# EAGLE board Robotics_Cape (EAGLE 7.7.0)
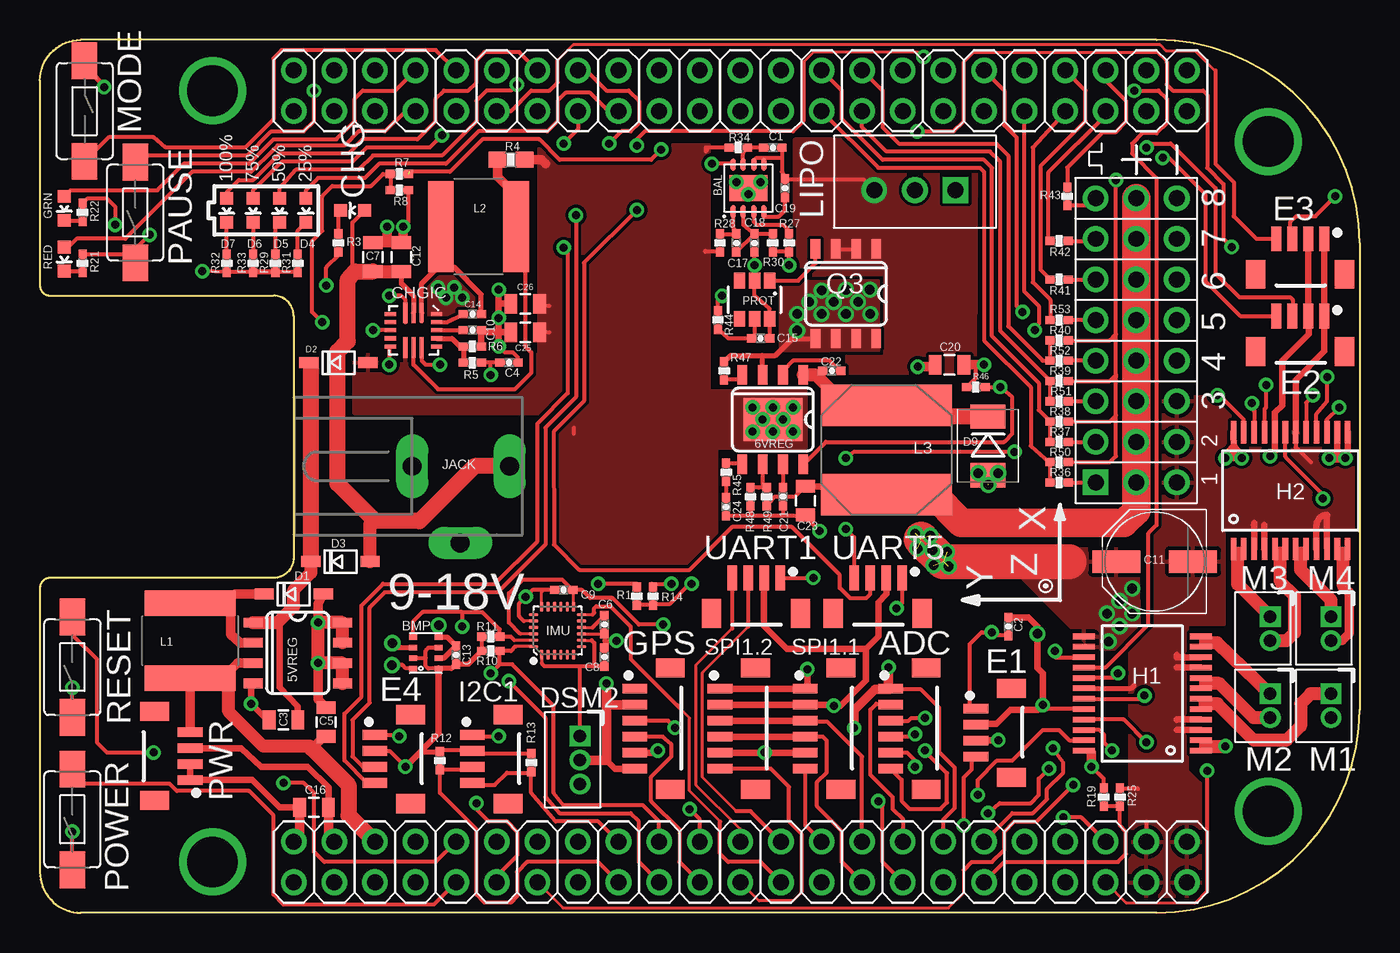
[diagram p1: board, top side]
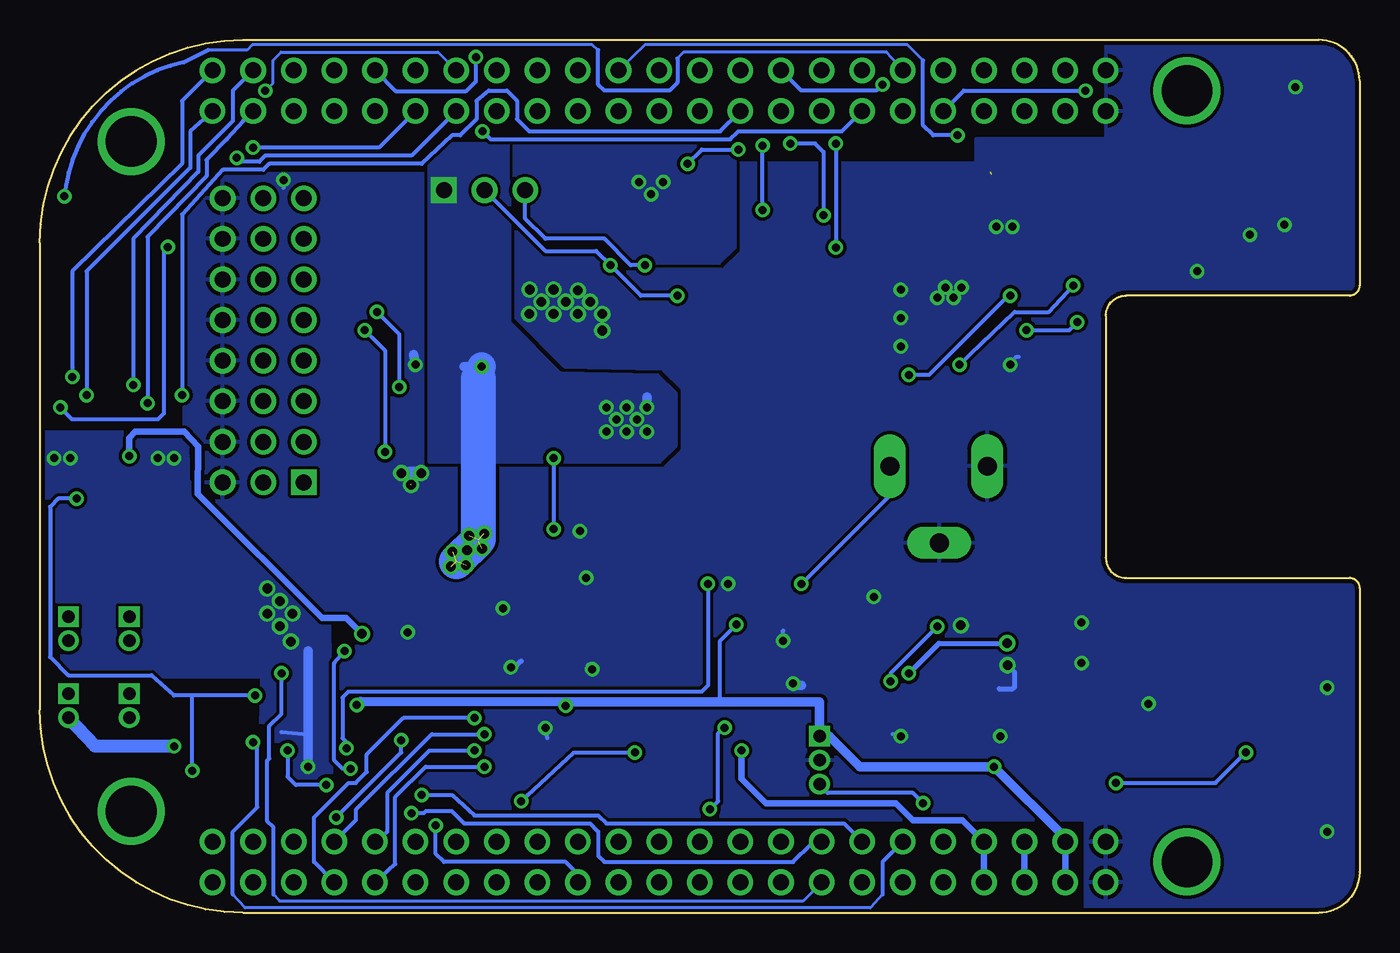
[diagram p2: board, bottom side, seen from below]

Size 82.55 x 54.61 mm. Coordinates in mm from the lower left corner, seen from the top.
Copper layers (1*16): Top 0.035mm / dielectric 1.5mm / Bottom 0.035mm
Design rules "SparkFun *": minimum track width 8mil, minimum drill 20mil, track to track 8mil, track to pad 8mil, pad to pad 8mil, via to via 8mil, smd to smd 8mil, copper to edge 10mil, drill to drill 8mil, minimum pad ring 10mil, minimum via ring 8mil, stop-mask expansion 4mil, vias tented up to drill 25mil, thermal gap 10mil

## Footprints (pad centres in the part's own frame; a part is rotated, then mirrored left to right if it is on the bottom)
SO08-TIGHT = smd 0.6 x 1.2: 1 -1.905,-2.8; 2 -0.635,-2.8; 3 0.635,-2.8; 4 1.905,-2.8; 5 1.905,2.8; 6 0.635,2.8; 7 -0.635,2.8; 8 -1.905,2.8
SO08-EXPOSED = smd 0.6 x 1.2: 1 -1.905,-2.8; 2 -0.635,-2.8; 3 0.635,-2.8; 4 1.905,-2.8; 5 1.905,2.8; 6 0.635,2.8; 7 -0.635,2.8; 8 -1.905,2.8 | smd 3.683 x 2.718: 9 0,0
JST_SH_6 = smd 0.6 x 1.55: 1 5,0; 2 4,0; 3 3,0; 4 2,0; 5 1,0; 6 0,0 | smd 1.2 x 1.8: P$1 -1.3,-2.225; P$2 6.3,-2.225
8-SON_3X3MM = smd 0.305 x 0.813: 1 -0.965,-1.473; 2 -0.33,-1.473; 3 0.33,-1.473; 4 0.965,-1.473; 5 0.965,1.473; 6 0.33,1.473; 7 -0.33,1.473 | smd 0.305 x 0.787: 8 -0.965,1.473 | smd 2.4 x 1.651: PAD 0,0
BEAGLEBONE_SHIELD = drill 1: 1 4.445,19.685; 2 1.905,19.685; 3 4.445,22.225; 4 1.905,22.225; 5 4.445,24.765; 6 1.905,24.765; 7 4.445,27.305; 8 1.905,27.305; 9 4.445,29.845; 10 1.905,29.845; 11 4.445,32.385; 12 1.905,32.385; 13 4.445,34.925; 14 1.905,34.925; 15 4.445,37.465; 16 1.905,37.465; 17 4.445,40.005; 18 1.905,40.005; 19 4.445,42.545; 20 1.905,42.545; 21 4.445,45.085; 22 1.905,45.085; 23 4.445,47.625; 24 1.905,47.625; 25 4.445,50.165; 26 1.905,50.165; 27 4.445,52.705; 28 1.905,52.705; 29 4.445,55.245; 30 1.905,55.245; 31 4.445,57.785; 32 1.905,57.785; 33 4.445,60.325; 34 1.905,60.325; 35 4.445,62.865; 36 1.905,62.865; 37 4.445,65.405; 38 1.905,65.405; 39 4.445,67.945; 40 1.905,67.945; 41 4.445,70.485; 42 1.905,70.485; 43 4.445,73.025; 44 1.905,73.025; 45 4.445,75.565; 46 1.905,75.565; 47 52.705,19.685; 48 50.165,19.685; 49 52.705,22.225; 50 50.165,22.225; 51 52.705,24.765; 52 50.165,24.765; 53 52.705,27.305; 54 50.165,27.305; 55 52.705,29.845; 56 50.165,29.845; 57 52.705,32.385; 58 50.165,32.385; 59 52.705,34.925; 60 50.165,34.925; 61 52.705,37.465; 62 50.165,37.465; 63 52.705,40.005; 64 50.165,40.005; 65 52.705,42.545; 66 50.165,42.545; 67 52.705,45.085; 68 50.165,45.085; 69 52.705,47.625; 70 50.165,47.625; 71 52.705,50.165; 72 50.165,50.165; 73 52.705,52.705; 74 50.165,52.705; 75 52.705,55.245; 76 50.165,55.245; 77 52.705,57.785; 78 50.165,57.785; 79 52.705,60.325; 80 50.165,60.325; 81 52.705,62.865; 82 50.165,62.865; 83 52.705,65.405; 84 50.165,65.405; 85 52.705,67.945; 86 50.165,67.945; 87 52.705,70.485; 88 50.165,70.485; 89 52.705,73.025; 90 50.165,73.025; 91 52.705,75.565; 92 50.165,75.565 | drill 3.175: P$1 6.35,80.645; P$2 48.26,80.645; P$3 3.175,14.605; P$4 51.435,14.605
BMP280 = smd 0.5 x 0.35: 1 0.8,0.975; 2 0.8,0.325; 3 0.8,-0.325; 4 0.8,-0.975; 5 -0.8,-0.975; 6 -0.8,-0.325; 7 -0.8,0.325; 8 -0.8,0.975
0402-CAP = smd 0.61 x 0.508: 1 -0.559,0; 2 0.559,0
0805 = smd 0.8 x 1.2: 1 -0.9,0; 2 0.9,0
PANASONIC_D = smd 3 x 1.4: + 2.4,0; - -2.4,0
LED-0603 = smd 0.8 x 0.8: A 0,-0.75; C 0,0.75
MP2615 = smd 1.295 x 0.254: 1 -1.092,0.508; 2 -1.092,0; 3 -1.092,-0.508; 9 1.092,-0.508; 10 1.092,0; 11 1.092,0.508 | smd 0.254 x 0.711: 4 -1.016,-1.448; 5 -0.508,-1.448; 6 0,-1.448; 7 0.508,-1.448; 8 1.016,-1.448; 12 1.016,1.448; 13 0.508,1.448; 14 0,1.448; 15 -0.508,1.448; 16 -1.016,1.448
SOD-123 = smd 1.2 x 0.7: A 1.85,0; C -1.85,0
DO-214AA = smd 1.524 x 2.184: A 1.841,0; C -1.841,0
JST_ZH_3 = drill 0.787 square: P$1 0,0 | drill 0.787: P$2 1.499,0; P$3 2.997,0
JST_SH_4_SMD = smd 0.6 x 1.55: 1 0.46,1.27; 2 -0.54,1.27; 3 -1.54,1.27; 4 -2.54,1.27 | smd 1.2 x 1.8: P$1 -3.84,-0.955; P$2 1.728,-0.955
SSOP24 = smd 0.348 x 1.397: 1 -3.575,-3.656; 2 -2.925,-3.656; 3 -2.275,-3.656; 4 -1.625,-3.656; 5 -0.975,-3.656; 6 -0.325,-3.656; 7 0.325,-3.656; 8 0.975,-3.656; 9 1.625,-3.656; 10 2.275,-3.656; 11 2.925,-3.656; 12 3.575,-3.656; 13 3.575,3.656; 14 2.925,3.656; 15 2.275,3.656; 16 1.625,3.656; 17 0.975,3.656; 18 0.325,3.656; 19 -0.325,3.656; 20 -0.975,3.656; 21 -1.625,3.656; 22 -2.275,3.656; 23 -2.925,3.656; 24 -3.575,3.656
QFN24G-0.4-3X3MM = smd 0.6 x 0.2: 1 -1.5,1; 2 -1.5,0.6; 3 -1.5,0.2; 4 -1.5,-0.2; 5 -1.5,-0.6; 6 -1.5,-1; 13 1.5,-1; 14 1.5,-0.6; 15 1.5,-0.2; 16 1.5,0.2; 17 1.5,0.6; 18 1.5,1 | smd 0.2 x 0.6: 7 -1,-1.5; 8 -0.6,-1.5; 9 -0.2,-1.5; 10 0.2,-1.5; 11 0.6,-1.5; 12 1,-1.5; 19 1,1.5; 20 0.6,1.5; 21 0.2,1.5; 22 -0.2,1.5; 23 -0.6,1.5; 24 -1,1.5
DCJ0303 = drill 1.181 pad 2 long: 1 0,3.1; 2 4.8,0; 3 0,-3
TAIYO_NRS = smd 1.6 x 5.7: 1 -2.349,0; 2 2.349,0
8X8MM_INDUCTOR = smd 2.591 x 8.204: 1 -2.794,0; 2 2.794,0
JST_XH_3-PIN = drill 1 square: P$1 0,0 | drill 1: P$2 0,-2.54; P$3 0,-5.08
JST_ZH_2 = drill 0.787 pad 1.219 square: P$1 -0.749,0 | drill 0.787 pad 1.219: P$2 0.749,0
TACTILE-SWITCH-1101NE = smd 2.3 x 1.6: P$1 -3.15,0; P$2 3.15,0
SOT-236 = smd 0.991 x 0.711: 1 -1.194,0.94; 2 -1.194,0; 3 -1.194,-0.94; 4 1.194,-0.94; 5 1.194,0; 6 1.194,0.94
0402-RES = smd 0.61 x 0.508: 1 -0.559,0; 2 0.559,0
0603-RES = smd 1.1 x 1: 1 -0.85,0; 2 0.85,0
3X8_0.1"_HEADER = drill 1 square: P$1 -2.54,-17.78 | drill 1: P$2 -2.54,-15.24; P$3 -2.54,-12.7; P$4 -2.54,-10.16; P$5 -2.54,-7.62; P$6 -2.54,-5.08; P$7 0,-17.78; P$8 0,-15.24; P$9 0,-12.7; P$10 0,-10.16; P$11 0,-7.62; P$12 0,-5.08; P$13 2.54,-17.78; P$14 2.54,-15.24; P$15 2.54,-12.7; P$16 2.54,-10.16; P$17 2.54,-7.62; P$18 2.54,-5.08; P$19 -2.54,-2.54; P$20 -2.54,0; P$21 0,-2.54; P$22 0,0; P$23 2.54,-2.54; P$24 2.54,0

## Placement (x,y rotation side)
5VREG  AP1509SOIC-8-TIGHT  [SO08-TIGHT]  16.13,16.26 270 top
6VREG  AOZ1284  [SO08-EXPOSED]  45.85,30.86 180 top
ADC  JST_SH_6  [JST_SH_6]  53.21,9.02 90 top
BAL  BQ29209  [8-SON_3X3MM]  44.32,45.34 0 top
BBB_HEADERS  BEAGLEBONE_OUTLINE  [BEAGLEBONE_SHIELD]  -3.81,54.61 270 top
BMP  BMP280  [BMP280]  24.13,16.26 180 top
C1  0.1uF  [0402-CAP]  45.85,47.88 0 top
C2  0.1uF  [0402-CAP]  60.58,17.91 90 top
C3  10uF 25V  [0805]  15.24,12.06 180 top
C4  1uF  [0402-CAP]  29.34,34.42 180 top
C5  10uF 25V  [0805]  17.91,11.94 90 top
C6  0.1uF  [0402-CAP]  35.31,18.03 270 top
C7  10uF 25V  [0805]  20.83,41.02 90 top
C8  0.1uF  [0402-CAP]  35.31,16 90 top
C9  0.1uF  [0402-CAP]  32.77,20.19 0 top
C10  1uF  [0402-CAP]  27.05,36.45 180 top
C11  100uF 16V  [PANASONIC_D]  69.72,21.97 180 top
C12  10uF 25V  [0805]  22.61,41.02 90 top
C13  0.1uF  [0402-CAP]  26.04,16.13 90 top
C14  0.1uF  [0402-CAP]  27.05,37.47 0 top
C15  0.1uF  [0402-CAP]  45.09,35.94 180 top
C16  10uF 25V  [0805]  17.14,6.6 180 top
C17  0.1uF  [0402-CAP]  43.56,41.91 90 top
C18  0.1uF  [0402-CAP]  44.7,41.91 90 top
C19  0.1uF  [0402-CAP]  46.61,45.34 90 top
C20  10uF 25V  [0805]  56.9,34.29 180 top
C21  0.1uF  [0402-CAP]  46.48,26.04 90 top
C22  0.1uF  [0402-CAP]  49.53,33.91 180 top
C23  10uF 25V  [0805]  47.88,25.78 90 top
C24  0.1uF  [0402-CAP]  42.93,25.4 90 top
C25  10uF 25V  [0805]  30.35,36.32 180 top
C26  10uF 25V  [0805]  30.35,38.1 180 top
CHG  GRN  [LED-0603]  19.56,43.94 90 top
CHGIC  MP2615  [MP2615]  23.37,36.45 270 top
D1  [SOD-123]  15.87,19.94 0 top
D2  [SOD-123]  18.67,34.42 0 top
D3  [SOD-123]  18.8,21.97 0 top
D4  RED  [LED-0603]  16.64,43.94 180 top
D5  GREEN  [LED-0603]  14.99,43.94 180 top
D6  GREEN  [LED-0603]  13.33,43.94 180 top
D7  GREEN  [LED-0603]  11.68,43.94 180 top
D9  [DO-214AA]  59.31,29.21 270 top
DSM2  JST_ZH_3  [JST_ZH_3]  33.78,11.05 270 top
E1  JST_SH_4  [JST_SH_4_SMD]  59.82,12.32 90 top
E2  JST_SH_4  [JST_SH_4_SMD]  79.88,36.07 0 top
E3  JST_SH_4  [JST_SH_4_SMD]  79.88,40.89 0 top
E4  JST_SH_4  [JST_SH_4_SMD]  22.23,10.67 90 top
E$1  [BATTERY_INDICATOR]  14.22,43.94 0 top
GPS  JST_SH_6  [JST_SH_6]  37.21,9.02 90 top
GRN  GRN  [LED-0603]  1.52,44.07 180 top
H1  TB6621FNG  [SSOP24]  68.96,13.72 90 top
H2  TB6621FNG  [SSOP24]  78.23,26.42 0 top
I2C1  JST_SH_4  [JST_SH_4_SMD]  28.32,10.67 90 top
IMU  MPU-9250  [QFN24G-0.4-3X3MM]  32.38,17.65 90 top
JACK  5.5x2.1mm  [DCJ0303]  26.29,27.94 270 top
L1  6.8uH  [TAIYO_NRS]  9.4,17.02 270 top
L2  6.8uH  [TAIYO_NRS]  27.43,42.93 0 top
L3  3.3uH  [8X8MM_INDUCTOR]  52.96,28.96 270 top
LIPO  [JST_XH_3-PIN]  57.28,45.21 270 top
M1  JST_ZH_2  [JST_ZH_2]  80.77,12.95 270 top
M2  JST_ZH_2  [JST_ZH_2]  76.96,12.95 270 top
M3  JST_ZH_2  [JST_ZH_2]  76.96,17.78 270 top
M4  JST_ZH_2  [JST_ZH_2]  80.77,17.78 270 top
MODE  SWITCH-MOMENTARY-2-SMD-1101NE  [TACTILE-SWITCH-1101NE]  2.79,50.16 270 top
PAUSE  SWITCH-MOMENTARY-2-SMD-1101NE  [TACTILE-SWITCH-1101NE]  5.97,43.81 90 top
POWER  SWITCH-MOMENTARY-2-SMD-1101NE  [TACTILE-SWITCH-1101NE]  2.03,5.84 90 top
PROT  S-8261  [SOT-236]  44.7,38.35 270 top
PWR  JST_SH_4  [JST_SH_4_SMD]  8.13,8.76 270 top
Q3  MOSFET-N  [SO08-TIGHT]  50.42,38.73 180 top
R1  47k  [0402-RES]  37.34,19.81 270 top
R3  1k  [0402-RES]  18.67,41.91 90 top
R4  0.1  [0603-RES]  29.46,47.12 180 top
R5  10k  [0402-RES]  27.05,34.42 0 top
R6  10k  [0402-RES]  27.05,35.43 180 top
R7  4.7k  [0402-RES]  22.48,46.23 180 top
R8  10k  [0402-RES]  22.48,45.21 0 top
R10  4.7k  [0402-RES]  28.19,16.38 0 top
R11  4.7k  [0402-RES]  28.19,17.27 180 top
R12  4.7k  [0402-RES]  25.02,9.53 90 top
R13  4.7k  [0402-RES]  30.73,9.4 270 top
R14  4.7k  [0402-RES]  38.35,19.81 90 top
R19  47k  [0402-RES]  66.55,7.24 270 top
R21  261  [0402-RES]  2.67,40.64 90 top
R22  261  [0402-RES]  2.67,43.81 90 top
R25  4.7k  [0402-RES]  67.56,7.24 90 top
R27  160  [0402-RES]  46.86,41.91 90 top
R28  160  [0402-RES]  42.54,41.91 90 top
R29  261  [0402-RES]  14.73,40.64 270 top
R30  261  [0402-RES]  45.85,41.91 90 top
R31  261  [0402-RES]  16.13,40.64 270 top
R32  261  [0402-RES]  11.68,40.64 270 top
R33  261  [0402-RES]  13.33,40.64 270 top
R34  160  [0402-RES]  43.69,47.88 0 top
R36  4.7k  [0402-RES]  63.75,26.92 0 top
R37  4.7k  [0402-RES]  63.75,29.46 0 top
R38  4.7k  [0402-RES]  63.75,32 0 top
R39  4.7k  [0402-RES]  63.75,34.54 0 top
R40  4.7k  [0402-RES]  63.75,37.08 0 top
R41  4.7k  [0402-RES]  63.75,39.62 0 top
R42  4.7k  [0402-RES]  63.75,42.04 0 top
R43  4.7k  [0402-RES]  64.26,44.83 270 top
R44  1k  [0402-RES]  42.42,37.08 270 top
R45  47k  [0402-RES]  42.93,27.56 90 top
R46  1K  [0402-RES]  58.55,32.89 0 top
R47  100k  [0402-RES]  42.8,33.91 270 top
R48  10k  [0402-RES]  44.45,26.04 90 top
R49  65k  [0402-RES]  45.47,26.04 270 top
R50  4.7k  [0402-RES]  63.75,28.19 0 top
R51  4.7k  [0402-RES]  63.75,30.73 0 top
R52  4.7k  [0402-RES]  63.75,33.27 0 top
R53  4.7k  [0402-RES]  63.75,35.81 0 top
RED  RED  [LED-0603]  1.52,40.89 180 top
RESET  SWITCH-MOMENTARY-2-SMD-1101NE  [TACTILE-SWITCH-1101NE]  2.03,15.37 90 top
SPI1.1  JST_SH_6  [JST_SH_6]  47.88,9.02 90 top
SPI1.2  JST_SH_6  [JST_SH_6]  42.54,9.02 90 top
U$1  SERVO_HEADERS_8X  [3X8_0.1"_HEADER]  68.58,44.7 0 top
U$5  [XYZ_BIG]  63.8,19.56 90 top
UART1  JST_SH_4  [JST_SH_4_SMD]  45.85,19.68 0 top
UART5  JST_SH_4  [JST_SH_4_SMD]  53.47,19.68 0 top

## Tracks (layer width: path | path; a pad name or v marks a point on that pad's centre or on a via)
3.3V  (via drill 0.5, 0.5 pad 0.25, 0.6 pad 0.61)
  Top 0.2: IMU.8 34.51,17.05 | IMU.13 33.38,20.19 | IMU.1 31.39,15.61 | IMU.22 30.04,17.45
  Top 0.254: E3.2 79.52,42.34 | 58.58,11.81 E1.2 | R11.2 R10.1 | UART5.2 52.96,20.92 52.96,20.19 | 26.96,10.03 I2C1.2 | 27.01,10.08 I2C1.2 | 79.38,37.31 E2.2 | v38.99,18.03 37.46,18.03 35.81,19.68 34.42,19.68 33.91,20.19 C9.2 | 49.47,13.02 v49.66,12.95 | H1.20 62.99,12.74 v62.74,12.99 | 34.51,17.05 34.67,16.89 34.67,15.44 | 33.38,20.19 C9.2 | C9.2 32.69,20.83 30.18,20.83 29.34,19.99 29.34,18.16 30.04,17.45 | E4.2 21.88,10.13 v22.86,9.14 | 34.67,15.44 C8.1 | 31.39,15.61 31.55,15.44 33.78,15.44 | 33.78,15.44 34.67,15.44 | DSM2.P$1 33.78,15.44 | 27.08,10.16 25.02,10.16 R12.2 | R13.1 27.05,9.96 I2C1.2 | BMP.8 24.29,15.28 24.13,15.44 24.13,15.95 | 24.13,15.95 24.13,16.41 24.3,16.58 BMP.6 | BMP.2 24.11,15.93 24.13,15.95
  Top 0.305: R12.2 25.07,10.03 23.75,10.03 v22.86,9.14 | 27.08,10.16 I2C1.2 | BMP.8 25.75,15.28 C13.1 26.82,15.57 R10.1 | 24.88,14.12 24.93,14.17
  Top 0.406: E2.2 E3.2 | C16.1 18.05,7.86 16.74,9.14 13.84,9.14 12.57,10.29 9.41,10.29 PWR.3 | 58.58,11.81 59.82,11.81 60.71,12.7 62.44,12.7 v62.74,12.99 62.74,14.99 62.41,15.32 v62.41,17.45 62.41,17.91 61.85,18.47 C2.2 60.6,18.44 | v76.96,28.57 77.26,28.87 H2.20 77.26,31.28 77.72,31.75 77.72,34.54 79.38,36.2 79.38,37.31 | UART1.2 45.31,17.94 46.74,16.51 51.66,16.51 | 52.96,20.19 52.96,19.94 52.45,19.43 52.45,17.3 51.66,16.51 | 49.47,13.02 SPI1.1.2 SPI1.2.2 | v22.86,9.14 24.93,11.21 24.93,14.17 BMP.8 | 51.66,16.51 51.66,14.53 50.09,12.95 v49.66,12.95
  Top 0.61: BBB_HEADERS.50 18.05,4.82 C16.1
  Bottom 0.254: v38.99,18.03 40,17.02 40,13.21 38.99,13.21 | v49.66,12.95 49.78,13.21
  Bottom 0.406: BBB_HEADERS.50 BBB_HEADERS.49 | v76.96,28.57 76.96,29.72 76.58,30.1 73.53,30.1 72.64,29.16 72.67,26.21 64.9,18.44 63.4,18.44 v62.41,17.45
  Bottom 0.61: BBB_HEADERS.50 18.42,4.7 v22.86,9.14 31.24,9.14 33.15,11.05 DSM2.P$1 33.78,13.21 38.99,13.21 49.78,13.21 62.5,13.23 v62.74,12.99
5.0V
  Top 0.61: PWR.4 L1.2 9.4,14.72 | C5.1 17.77,11.04 17.02,10.28 | 5VREG.3 12.37,15.62 11.63,14.88
  Top 0.813: L1.2 11.63,14.88 11.81,14.89 11.81,12.57 13.97,10.41 16.89,10.41 17.02,10.28
  Top 1.016: 17.02,10.28 19.3,7.99 19.3,6.1 BBB_HEADERS.52
  Bottom 0.406: BBB_HEADERS.51 BBB_HEADERS.52
AIN0  (via drill 0.5 pad 0.25)
  Top 0.254: ADC.3 54.33,12.02 54.51,12.19 v55.37,12.19
  Bottom 0.254: BBB_HEADERS.85 65.41,3.17 65.41,5.97 63.25,8.13 62.79,8.13 62.1,8.81 62.1,9.91 59.82,12.19 v55.37,12.19
AIN1  (via drill 0.5 pad 0.25)
  Top 0.254: v54.74,11.18 54.64,11.02 ADC.4
  Bottom 0.254: v54.74,11.18 58.04,11.18 62.79,6.43 62.79,5.79 BBB_HEADERS.86
AIN2  (via drill 0.5 pad 0.25)
  Top 0.254: v54.74,9.14 54.74,9.53 54.25,10.01 53.22,10.01 ADC.5
  Bottom 0.254: BBB_HEADERS.83 60.33,3.05 60.33,7.24 58.42,9.14 v54.74,9.14
AIN3  (via drill 0.5 pad 0.25)
  Top 0.254: ADC.6 53.9,8.33 53.9,7.01 54.41,6.5 56.34,6.5 56.74,6.91 56.74,8.74 55.37,10.11 v55.37,10.16
  Bottom 0.254: BBB_HEADERS.84 60.83,5.08 60.83,7.49 58.17,10.16 v55.37,10.16
BALANCE_PAD  (via drill 0.5 pad 0.25)
  other vias: 43.56,45.72 44.32,44.96 45.09,45.72
  pour Bottom: 52.83,48.39 39.12,48.39 39.12,41.63 40.13,40.61 45.21,40.64 52.83,43.18
BATT_MID  (via drill 0.5)
  Top 0.254: v46.86,40.51 R27.1 R30.1 | R44.1 42.42,38.35 v42.67,38.61
  Bottom 0.254: v42.67,38.61 44.96,38.61 v46.86,40.51 47.75,41.4 50.93,41.4 LIPO.P$2
BATT_MINUS  (via drill 0.5)
  Top 0.254: C15.1 PROT.6 45.64,37.8 44.7,38.61 PROT.2 v44.7,40.51 C18.1 | C1.2 46.41,47.24 | 46.41,47.24 46.41,46.35 C19.2 51.51,45.9 LIPO.P$3 | BAL.6 44.65,47.07 44.83,47.24 45.21,47.24 | 45.21,47.24 46.41,47.24 | BAL.5 45.29,47.17 45.21,47.24 | Q3.3 50.93,41.53 51.05,41.66
  Bottom 0.254: v44.7,40.51 45.59,40.51 47.24,42.16 50.93,42.16 52.2,43.43 LIPO.P$3
  pour Top (rank 6, no thermals): 47.24,48.39 58.55,48.39 58.5,33.76 50.52,33.73 50.57,39.6 47.24,39.62
CHG_EN  (via drill 0.5)
  Top 0.254: CHGIC.6 v20.83,36.45 | v17.65,36.96 17.02,37.59 17.02,42.04 17.65,42.67 17.65,44.83 18.29,45.47 20.7,45.47 21.46,46.23 R7.2 R8.1
  Bottom 0.254: v20.83,36.45 18.16,36.45 v17.65,36.96
CO  (via drill 0.5)  (1 unrouted)
  Top 0.254: BAL.8 43.31,46.86 v42.04,46.86 | v38.86,47.75 38.23,47.12 32.51,47.12 31.24,48.39 27.69,48.39 25.65,46.35 23.11,46.35
  Bottom 0.254: v42.04,46.86 41.15,47.75 v38.86,47.75
DO
  Top 0.254: PROT.1 47.42,39.55 48.51,40.64 Q3.4
GND  (via drill 0.5, 0.5 pad 0.25, 0.6, 0.6 pad 0.25)  (1 unrouted)
  Top 0.2: IMU.20 30.26,18.25 | IMU.9 35.12,17.45 | IMU.18 31.39,20.13
  Top 0.254: H1.4 72.62,12.04 | 69.22,5.71 BBB_HEADERS.90 | 58.63,12.7 E1.1 58.17,12.78 58.17,16.82 58.9,17.55 v59.54,17.55 59.74,17.35 C2.1 | R33.2 R32.2 | R22.2 3,44.7 4.19,44.7 4.7,44.2 v4.7,43.05 | R21.2 5.43,41.2 arc-90 PAUSE.P$1 5.97,41.53 v6.86,42.42 | R32.2 R29.2 R31.2 | R32.2 v10.16,40.13 | POWER.P$1 v2.03,5.08 | RESET.P$1 v2.03,14.1 | UART5.1 53.93,19.38 v53.59,19.05 | v48.77,23.88 47.88,24.77 C23.1 47.87,24.89 47.82,24.84 46.48,24.84 | R25.2 68.66,7.8 68.71,7.75 | 46.18,20.95 UART1.1 v48.39,20.95 | 53.17,13.97 ADC.1 53.26,13.97 55.12,13.97 56.26,12.83 56.26,10.03 57.23,9.07 57.23,6.55 56.52,5.84 BBB_HEADERS.80 | 27.05,11.18 I2C1.1 27.13,11.05 v28.7,11.05 | R14.2 38.28,20.57 v39.5,20.57 | E4.1 22.4,11.13 v22.48,11.05 | R47.1 42.75,34.54 | H2.10 80.51,22.87 | H2.18 78.56,29.14 79.5,28.19 | 30.26,18.25 29.97,18.54 29.97,19.36 v30.38,19.76 30.81,20.19 31.32,20.19 | 35.31,17.02 C8.2 | C6.2 35.31,17.4 | 35.31,17.4 35.31,17.02 | 35.31,17.02 v36.07,17.02 | 35.12,17.45 arc-90 35.31,17.4 | R53.2 66.93,35.81 67.31,36.2 | 67.31,36.2 v67.31,45.85 | R52.2 66.93,33.27 67.25,33.59 | 67.25,33.59 67.31,33.66 67.31,36.2 | R51.2 66.93,30.73 67.31,31.11 | 67.31,31.11 67.31,33.53 67.25,33.59 | R50.2 66.93,28.19 67.31,28.57 67.31,31.11 | CHGIC.8 21.84,35.36 v21.84,34.29 | R8.2 23.04,43.23 v22.73,42.93 | 46.48,24.84 44.45,24.84 | 44.45,24.84 C24.1 | C21.1 46.48,24.84 | R48.1 44.45,24.84 | R46.1 58.55,33.45 58.55,34.29 | C4.1 29.9,34.75 29.59,35.05 29.08,35.05 v28.7,35.43 | C9.1 31.32,20.19 | 31.39,20.13 31.32,20.19 | 23.3,15.29 22.89,15.29 22.68,15.49 v22.02,15.49
  Top 0.305: R29.2 R33.2 | H1.18 68.27,14.04 68.45,14.22 | SPI1.1.1 48.01,14.14 | MODE.P$1 3.45,52.32 v4.01,51.66 | BMP.1 23.32,15.27 23.3,15.29 | BMP.5 | BMP.7 25.28,15.93 C13.2 25.49,17.23 BMP.5 | BMP.5 24.93,17.74 v24.94,17.98 | R47.1 43.2,34.87 45.19,34.87 | 45.19,34.87 46.02,34.87 47.09,35.94 Q3.5 | 6VREG.3 45.19,33.69 45.19,34.87
  Top 0.406: H1.9 71.12,15.34 | H1.4 71.12,12.09 71.12,12.06 | H1.3 71.12,11.44 71.12,11.43 | H1.10 71.12,15.99 71.12,16.13 | H2.3 75.96,24.37 75.95,24.26 | E3.1 E2.1 80.34,35.13 78.56,33.34 H2.18 | 5VREG.4 13.23,14.27 v13.21,13.08 14.21,12.08 C3.2 | PWR.2 PWR.1 13.29,8.3 14.99,6.6 C16.2 | SPI1.2.1 SPI1.1.1 | 48.01,14.14 v48.01,15.24 | H2.4 76.61,24.23 arc90 76.58,24.26 | 80.51,22.87 80.51,24.88 arc-90 80.52,24.89 arc90 79.86,24.23 H2.9 | 29.33,36.45 C25.2 28.7,36.32 | R6.1 C10.1 27.74,36.32 28.7,36.32 | v28.7,38.99 28.7,38.1 | 28.7,38.1 v28.7,37.21 28.7,36.32 | 28.7,36.32 v28.7,35.43 | C26.2 28.7,38.1 | GPS.6 35.97,9.02 35.43,9.55 | 58.8,27.24 58.91,27.24 59.33,26.82
  Top 0.61: D1.A 17.4,19.36 v17.4,18.16 | BBB_HEADERS.48 16.25,4.84 C16.2 | 17.39,15.61 v17.4,15.62 17.4,13.35 C5.2 | C20.1 58.55,34.29 v59.05,34.29 | v53.09,15.37 53.09,14.02 ADC.1 | 53.17,13.97 52.25,13.97 50.93,12.65 v50.93,11.56 | 35.43,13.02 35.43,9.55 DSM2.P$2 | 35.43,13.02 v35.43,14.35 | GPS.2 35.43,13.02 | 29.45,36.56 C25.2 29.45,36.08 | C26.2 29.45,37.86 | v22.73,42.93 22.73,42.05 C12.2 21.72,41.92 | 21.72,41.92 v21.72,42.93 | C7.2 21.72,41.92
  Top 0.813: 5VREG.7 5VREG.8 v17.4,18.16 v17.4,15.62 5VREG.6 5VREG.5 | D9.A 58.8,27.24 | v58.7,27.51 v59.94,27.51
  Bottom 0.254: v48.77,23.88 48.89,23.88 | 50.8,10.92 v50.93,11.56 | v22.48,11.05 22.48,10.79 22.61,10.92 | v30.38,19.76 30.48,19.94 | v36.07,17.02 36.07,17.65 | v67.31,45.85 67.31,45.34 | v21.84,34.29 21.46,34.8 21.34,34.8 | v28.7,11.05 28.83,11.18 29.21,11.18
  Bottom 0.305: v53.09,15.37 52.83,15.37 52.45,15.75 | v48.01,15.24 48.26,15.49 | 22.55,14.02 21.69,14.02 21.59,14.12 21.59,15.04 v22.02,15.49 | v24.94,17.98 24.94,18.19 24.84,18.29
  Bottom 0.61: v59.05,34.29 59.18,34.92 | v35.43,14.35 35.31,14.22 34.92,14.22
  Bottom 0.813: v59.94,27.51 v58.7,27.51
  other vias: 48.89,37.47 47.37,37.47 50.42,37.47 51.94,37.47 48.13,38.23 49.66,38.23 51.18,38.23 24.89,39.12 25.4,38.48 25.91,39.12 26.42,38.48 48.89,38.94 50.42,38.99 51.92,38.99 47.37,36.42 59.33,26.77
  pour Bottom (rank 6): 0,54.61 15.87,54.61 15.87,48.39 24,48.39 24,46.86 50.29,46.86 50.29,43.56 58.55,43.56 58.55,46.23 73.53,46.23 73.53,14.35 73.28,13.59 73.28,5.84 17.14,5.84 17.14,0 0,0 0,20.95 15.87,20.95 15.87,38.23 0,38.23
  pour Top: 69.85,32.26 74.3,32.26 82.42,28.07 82.42,24 74.04,24 74.04,18.03 71.75,18.03 71.75,8.89 73.15,7.49 73.15,0.38 68.2,0.38 68.2,22.23 69.85,24.13
  pour Top (no thermals): 46.35,39.5 52.43,39.55 52.43,35.2 46.35,35.15
  pour Top (no thermals): 24.26,39.75 27.43,39.75 27.43,37.47 24.26,37.47
I2C1_SCL
  Top 0.254: I2C1.3 26.89,8.97 R12.1 25.02,7.49 27.3,5.21 27.3,1.14 27.81,0.64 29.46,0.64 29.85,1.02 29.85,2.54 30.48,3.17 34.92,3.17 BBB_HEADERS.63
I2C1_SDA
  Top 0.254: I2C1.4 26.92,8 28.45,8 29.21,8.76 30.66,8.76 R13.2 30.73,7.49 32.26,5.71 34.92,5.71 BBB_HEADERS.64
I2C2_SCL  (via drill 0.5)
  Top 0.2: IMU.23 29.68,17.05
  Top 0.254: 26.42,18.82 27.66,18.82 28.75,17.73 R11.1 29.46,17.27 29.68,17.05 | 26.42,18.82 v26.42,17.91 | v29.34,14.48 31.62,12.19 31.62,7.24 32.51,6.22 36.96,6.22 37.46,5.71 37.46,3.17 BBB_HEADERS.65 | 26.42,18.82 23.95,18.82 23.32,18.19 23.32,17.24 BMP.4
  Bottom 0.254: v26.42,17.91 29.34,14.99 v29.34,14.48
I2C2_SDA  (via drill 0.5 pad 0.25, 0.6)
  Top 0.2: IMU.24 29.73,16.65
  Top 0.254: BBB_HEADERS.66 38.73,5.71 37.72,6.73 32.77,6.73 32.13,7.49 32.13,12.95 29.54,15.54 28.75,15.54 | 28.77,16.4 R10.2 | v28.19,14.99 28.75,15.54 | 28.75,15.54 R10.2 | 29.73,16.65 29.46,16.38 R10.2
  Top 0.305: BMP.3 22.33,16.58 v22.05,16.87
  Bottom 0.305: v28.19,14.99 26.31,16.87 v22.05,16.87
IMU_INT
  Top 0.2: IMU.12 34.55,18.65
  Top 0.203: 42.54,5.71 40.64,7.62 40.64,12.19 39.85,12.98
  Top 0.254: BBB_HEADERS.71 45.09,3.17 43.05,3.17 42.54,3.68 42.54,5.71 | 40,12.83 39.85,12.98 36.96,15.88 36.96,17.91 35.69,19.18 34.8,19.18 34.67,19.05 34.67,18.77 34.55,18.65
L3
  Top 0.254: D6.C R33.1
L4
  Top 0.254: R32.1 D7.C 11.43,43.31 D7.C
LED_1
  Top 0.254: D4.A 16.64,45.21 17.4,45.97 20.32,45.97 21.21,46.86 25.4,46.86 27.43,48.9 31.75,48.9 32.38,49.53 32.38,50.8 32.89,51.31 34.42,51.31 35.56,50.16 BBB_HEADERS.17
LED_2  (via drill 0.5)
  Top 0.254: D5.A 14.99,45.34 16,46.48 19.94,46.48 20.83,47.37 25.15,47.37 27.3,49.53 27.3,50.8 27.94,51.44 29.46,51.44 v29.85,51.82
  Bottom 0.254: BBB_HEADERS.18 34.92,51.44 30.23,51.44 v29.85,51.82
LED_3  (via drill 0.5)
  Top 0.254: D6.A 13.33,45.21 15.11,46.99 19.56,46.99 20.45,47.88 24.38,47.88 v25.15,48.64
  Bottom 0.203: 27.3,53.34 28.27,54.3 44.7,54.3 BBB_HEADERS.26
  Bottom 0.254: 27.3,53.34 27.3,49.28 26.67,48.64 v25.15,48.64
LED_4
  Top 0.254: BBB_HEADERS.14 29.97,53.85 27.81,53.85 27.3,53.34 27.3,51.94 26.8,51.44 25.27,51.44 24.77,50.93 24.77,49.53 23.62,48.39 20.19,48.39 19.3,47.5 14.99,47.5 13.33,45.85 12.45,45.85 11.68,45.09 D7.A
LED_GRN
  Top 0.254: GRN.A 1.92,45.21 7.34,45.21 8.99,46.86 13.08,46.86 14.6,48.39 18.54,48.39 19.69,49.53 19.69,50.93 20.19,51.44 22.23,51.44 BBB_HEADERS.8
LED_RED
  Top 0.254: RED.A 1.77,41.64 2.29,42.16 5.33,42.16 9.53,46.35 13.21,46.35 14.6,47.75 14.86,48.01 19.05,48.01 19.94,48.9 21.59,48.9 22.86,50.16 BBB_HEADERS.7
MDIR_1A  (via drill 0.5)
  Top 0.254: v69.22,10.67 67.79,12.09 H1.21
  Bottom 0.203: 29.85,1.14 30.61,0.3 69.72,0.3 70.48,1.14
  Bottom 0.254: BBB_HEADERS.58 29.85,3.17 29.85,1.14 | 70.48,1.14 70.48,5.08 68.96,6.6 68.96,10.41 v69.22,10.67
MDIR_1B  (via drill 0.5)
  Top 0.203: 57.78,2.67 57.78,1.25 56.84,0.3 32.71,0.3 BBB_HEADERS.59
  Top 0.254: 57.78,2.67 58.29,3.17 59.56,3.17 60.33,3.94 60.33,5.08 60.96,5.71 62.36,5.71 v64.64,8 | H1.22 66.28,11.44 66.55,11.18 66.55,10.67 v67.06,10.16
  Bottom 0.254: v67.06,10.16 67.06,8.51 66.55,8 v64.64,8
MDIR_2A  (via drill 0.5)
  Top 0.254: v67.44,14.99 67.52,14.69 H1.17
  Bottom 0.203: 67.94,1.14 67.56,0.74 34.8,0.74 BBB_HEADERS.61
  Bottom 0.254: v67.44,14.99 67.44,12.45 68.2,11.68 68.2,9.65 68.33,9.53 68.33,5.71 67.94,5.33 67.94,1.14
MDIR_2B  (via drill 0.5)
  Top 0.254: v68.45,51.44 69.98,51.44 70.48,50.93 70.48,49.4 69.85,48.77 68.96,48.77 68.33,48.13 68.33,47.5 69.85,45.97 69.85,24.26 69.34,23.75 69.34,18.03 66.67,15.37 65.33,15.37 H1.16
  Bottom 0.203: v68.45,51.44 67.97,51.92 67.97,53.34 67.46,53.85 57.66,53.85 BBB_HEADERS.34
MDIR_3A  (via drill 0.5)
  Top 0.254: H2.21 76.61,31.52 76.71,31.62 v76.71,33.02
  Bottom 0.254: BBB_HEADERS.44 70.48,51.44 70.48,49.53 72.64,47.37 72.64,46.35 76.71,42.16 v76.71,33.02
MDIR_3B  (via drill 0.5)
  Top 0.254: v75.82,31.88 75.95,31.5 75.96,31.38 H2.22
  Bottom 0.254: BBB_HEADERS.43 69.85,49.53 70.87,48.39 72.14,47.12 72.14,46.1 75.82,42.29 v75.82,31.88
MDIR_4A  (via drill 0.5)
  Top 0.254: v79.63,32.38 79.21,31.92 H2.17
  Bottom 0.254: BBB_HEADERS.45 73.15,48.9 73.15,46.61 79.63,40.13 v79.63,32.38
MDIR_4B  (via drill 0.5)
  Top 0.254: H2.16 79.86,31.22 80.52,32 v80.52,33.53
  Bottom 0.254: BBB_HEADERS.46 73.66,50.8 73.66,46.86 80.52,40.13 v80.52,33.53
MODE_BTN
  Top 0.254: BBB_HEADERS.10 24.77,53.98 15.11,53.98 14.6,53.47 14.6,49.66 12.83,47.88 7.87,47.88 7.11,48.51 4.29,48.51 MODE.P$2
MOT1A  (via drill 0.5)
  Top 0.254: H1.1 H1.2 72.99,10.41 73.15,10.41
  Top 0.813: 73.15,10.41 v74.17,10.41
  Bottom 0.813: v74.17,10.41 79.11,10.41 M1.P$2
MOT1B
  Top 0.254: H1.5 H1.6 73.02,12.98 73.02,12.95
  Top 0.813: M1.P$1 79.49,13.7 78.87,13.08 78.87,11.68 77.98,10.79 75.95,10.79 73.66,13.08 73.15,13.08 73.02,12.95
MOT2A
  Top 0.254: H1.11 H1.12 73.02,16.89
  Top 0.813: M2.P$1 73.65,16.89 73.02,16.89
MOT2B
  Top 0.254: H1.8 H1.7 72.93,14.35 73.02,14.35
  Top 0.813: M2.P$2 75.93,12.21 73.79,14.35 73.02,14.35
MOT3A
  Top 0.254: 75.06,22.48 75.06,22.64 H2.2 75.31,22.6 74.93,22.23
  Top 0.305: H2.1 H2.2
  Top 0.813: M3.P$1 74.93,20.56 74.93,22.23
MOT3B
  Top 0.254: 77.6,22.35 77.6,22.45 H2.6
  Top 0.305: H2.5 H2.6
  Top 0.813: M3.P$2 77.99,17.03 78.49,17.53 78.49,19.81 77.6,20.7 77.6,22.35
MOT4A
  Top 0.254: 81.53,22.35 81.53,22.49 H2.12
  Top 0.305: H2.11 H2.12
  Top 0.61: 81.53,20.45 81.91,20.07 81.91,17.48 81.48,17.04 80.78,17.04 M4.P$2
  Top 0.813: 81.53,20.45 81.53,22.35
MOT4B
  Top 0.254: 78.87,22.48 78.87,22.45 | 78.87,22.23 78.87,22.45 | 78.87,22.45 H2.7
  Top 0.305: H2.7 H2.8
  Top 0.813: M4.P$1 80.77,19.56 78.87,21.46 78.87,22.23
MOT_STBY  (via drill 0.5)
  Top 0.203: BBB_HEADERS.87 67.94,0.64 72.26,0.64 73.02,1.4
  Top 0.254: H1.19 68.78,13.39 v69.09,13.59 | 73.02,1.4 v73.02,8.89 | v80.26,25.91 80.14,26.29 77.91,28.52 H2.19 77.91,30.41
  Bottom 0.254: v69.09,13.59 73.02,13.59 | 73.02,13.59 74.17,13.59 75.56,14.86 80.77,14.86 81.91,16 81.91,25.4 81.41,25.91 v80.26,25.91 | v73.02,8.89 73.02,13.59
N$1
  Top 0.254: R36.2 U$1.P$1
N$3
  Top 0.254: GRN.C 2.6,43.32 R22.1
N$4
  Top 0.254: C17.1 C18.2 | R30.2 C18.2 | BAL.2 43.99,43.05 C18.2
N$6
  Top 0.254: RED.C 2.6,40.14 R21.1
N$8
  Top 0.254: BAL.1 43.36,42.9 C17.2 R28.2
N$10
  Top 0.254: 6VREG.7 C21.2
N$11
  Top 0.254: PROT.5 44.7,36.21 C15.2 43.07,35.94 R44.2
N$14
  Top 0.2: IMU.10 34.57,17.85
  Top 0.254: 34.57,17.85 C6.1
N$15
  Top 0.254: CHGIC.15 25.48,36.96 C14.1
N$16
  Top 0.61: D1.C 12.22,19.94 11.94,19.66 11.94,19.41 | 5VREG.2 12.52,16.89 11.94,17.42 11.94,19.41 | L1.1 11.9,19.37 11.94,19.41
N$17
  Top 0.254: R3.2 18.67,43.8 CHG.C
N$18  (via drill 0.5)
  Top 0.254: R3.1 18.67,41.15 17.91,40.39 v17.91,39.24 | CHGIC.11 23.88,34.54 24.13,34.29 v25.02,34.29
  Bottom 0.254: v25.02,34.29 21.59,37.59 19.43,37.59 v17.91,39.24
N$24
  Top 0.254: BAL.4 45.29,43.56 46.23,43.56 46.61,43.94 C19.1
N$25
  Top 0.254: R37.2 U$1.P$2
N$29
  Top 0.254: BAL.7 43.99,47.5 R34.2 C1.1
N$30
  Top 0.254: R38.2 U$1.P$3
N$38
  Top 0.254: U$1.P$4 R39.2
N$48
  Top 0.254: R29.1 14.73,42.94 arc-90 D5.C
N$49
  Top 0.254: R31.1 16.13,42.68 D4.C
N$50
  Top 0.254: BAL.3 44.65,43.23 44.83,43.05 46.48,43.05 46.86,42.67 R27.2
N$51
  Top 0.254: U$1.P$5 R40.2
N$52
  Top 0.254: R41.2 U$1.P$6
N$53
  Top 0.254: C22.1 50.04,33.91 49.4,34.54 47.12,34.54 46.48,33.91 6VREG.2
N$54
  Top 0.254: R42.2 65.91,42.04 U$1.P$19
N$55
  Top 0.305: CHGIC.1 23.88,39.37 25.02,40.51 25.02,40.77 | 25.02,40.77 25.02,42.51 L2.1 | C14.2 27.61,38.68 25.91,40.39 25.4,40.39 25.02,40.77
N$56
  Top 0.254: R43.2 65.61,44.27 U$1.P$20
N$60
  Top 0.254: C22.2 48.76,33.91 48.51,33.66
  Top 0.406: 49.66,31.75 L3.1 53.53,31.18
  Top 0.61: 53.78,31.05 L3.1
  Top 0.813: 6VREG.1 48.51,33.66 49.53,32.64 49.53,31.88 49.66,31.75
  Top 1.016: D9.C 53.78,31.05
N$61
  Top 0.254: R47.2 44.02,33.35 44.02,33.59 6VREG.4
N$62
  Top 0.254: R49.2 45.59,25.65 45.97,26.04 47.23,26.04 C23.2
  Top 0.406: C23.2 52.44,26.68 L3.2
  Top 1.778: L3.2 55.88,26.16 57.66,24.38 67.82,24.38 68.58,25.15 U$1.P$7 U$1.P$8 U$1.P$9 U$1.P$10 U$1.P$11 U$1.P$12 U$1.P$21 U$1.P$22
N$63
  Top 0.254: 6VREG.5 43.88,28.12 R45.2
N$65
  Top 0.254: R49.1 45.21,26.59 | R48.2 44.96,26.59 45.21,26.59 | 6VREG.6 45.21,26.59
N$66
  Top 0.254: R45.1 C24.2
N$67
  Top 0.254: 30.35,41.95 30.35,35.43 30.73,35.05 30.73,33.78 29.72,32.77 24.89,32.77 23.37,34.29 CHGIC.10
  Top 0.406: 30.35,41.95 29.78,41.95 L2.2
  Top 0.61: R4.2 28.61,46.06 29.77,44.91 L2.2
N$69
  Top 0.254: CHGIC.14 C10.2
N$71
  Top 0.305: CHGIC.13 25.78,35.94 26.29,35.43 R6.2 R5.1
N$79
  Top 0.305: 16.95,34.29 D2.C
  Top 0.406: C3.1 16.12,12.92 14.99,14.1 14.99,18.03 14.86,18.16
  Top 0.813: 5VREG.1 14.86,18.16 15.87,19.18 15.87,20.19 16.95,21.26 D3.C
  Top 1.016: 16.95,34.29 D3.C
PAUSE_BTN  (via drill 0.5)
  Top 0.254: 5.97,46.86 PAUSE.P$2 5.97,47.37 12.95,47.37 14.48,48.9 16.51,48.9 17.14,49.53 v17.14,51.44
  Bottom 0.254: BBB_HEADERS.9 24.77,51.44 v17.14,51.44
PWM_1A  (via drill 0.5 pad 0.25)
  Top 0.254: H1.23 64.39,10.79 63.75,11.43 62.74,11.43 60.83,9.53 59.87,9.53 58.67,8.31 v58.67,7.37
  Bottom 0.254: v58.67,7.37 56.77,7.37 55.37,6.1 47.62,6.1 47.12,5.59 32.26,5.59 BBB_HEADERS.60
PWM_1B  (via drill 0.5, 0.5 pad 0.25)
  Top 0.254: v63.5,16.38 63.51,15.99 H1.15 | v59.31,6.22 60.02,6.86 61.98,6.86 62.48,7.37 62.48,8.38 v63.12,9.02
  Bottom 0.254: v63.5,16.38 64.13,15.62 64.13,9.53 63.63,9.02 v63.12,9.02 | BBB_HEADERS.62 33.78,4.32 34.29,4.32 35.43,3.17 47.24,3.17 47.62,3.56 47.62,5.08 48.13,5.59 56.01,5.59 56.77,6.35 58.42,6.35 58.55,6.22 v59.31,6.22
PWM_2A  (via drill 0.5)
  Top 0.254: H2.23 75.31,30.86 73.79,32.38 v73.66,32.38
  Bottom 0.254: v73.66,32.38 73.66,43.69 71.12,46.48 68.58,46.48 68.2,46.86 58.67,46.86 56.77,48.64 56.26,48.64 55.24,49.66 55.24,50.8 54.48,51.44 53.34,51.44 52.7,50.8 52.7,49.66 51.94,48.9 40,48.9 BBB_HEADERS.19
PWM_2B  (via drill 0.5, 0.5 pad 0.25)
  Top 0.203: 57.78,53.21 58.42,53.85 69.88,53.85 70.48,53.24
  Top 0.254: v54.86,48.9 57.15,48.9 57.78,49.53 57.78,53.21 | H2.15 80.51,30.85 v81.28,31.62 | v74.55,41.66 74.04,42.16 74.04,45.59 73.02,46.61 73.02,51.18 72.77,51.44 70.87,51.44 70.48,51.82 70.48,53.24
  Bottom 0.254: v74.55,41.66 74.8,41.4 74.8,31.24 75.18,30.86 80.52,30.86 v81.28,31.62 | v54.86,48.9 54.36,48.39 39.37,48.39 38.86,48.9 32.38,48.9 BBB_HEADERS.13
PWR
  Top 0.254: 2.18,8.99 POWER.P$2 2.36,8.66 2.36,8.08 8.1,8.08 8.56,7.62 13.08,7.62 14.6,6.1 14.6,1.14 15.24,0.51 24.64,0.51 BBB_HEADERS.55
QEP_0A  (via drill 0.5)
  Top 0.254: 59.15,10.79 59.05,10.79 E1.3 | BBB_HEADERS.88 65.15,5.97 v64.01,5.97
  Top 0.406: v59.94,10.79 59.93,10.78 E1.3
  Bottom 0.254: v64.01,5.97 59.94,10.03 v59.94,10.79
QEP_0B  (via drill 0.5 pad 0.25)
  Top 0.254: v57.78,5.46 57.78,8.46 58.29,8.97 58.29,9.53 E1.4
  Bottom 0.254: BBB_HEADERS.73 48.89,2.41 49.66,3.17 57.28,3.17 57.78,3.68 v57.78,5.46
QEP_1A  (via drill 0.5)
  Top 0.254: E2.3 78.36,37.35 78.36,38.35 78.21,38.51 75.03,38.51 73.53,40.01 73.53,45.34 70.74,48.13 69.47,48.13 v69.22,47.88
  Bottom 0.254: BBB_HEADERS.35 61.34,47.88 v69.22,47.88
QEP_1B  (via drill 0.5)
  Top 0.254: v70.23,47.24 70.61,47.24 72.9,44.96 72.9,39.52 75.08,37.34 E2.4
  Bottom 0.254: BBB_HEADERS.33 59.31,47.37 68.45,47.37 68.83,46.99 69.98,46.99 v70.23,47.24
QEP_2A  (via drill 0.5)
  Top 0.254: E3.3 78.23,42.27 78.23,43.23 78.59,43.59 79.78,43.59 v81.03,44.83
  Bottom 0.203: BBB_HEADERS.12 29.59,53.85 42.29,53.85 42.67,53.47 | 72.03,53.98 69.6,53.98 69.27,54.3 48.01,54.3 47.62,53.98
  Bottom 0.254: 72.03,53.98 73.53,53.21 arc-75 81.03,44.58 v81.03,44.83 | 42.67,53.47 42.67,51.94 43.18,51.44 47.24,51.44 47.62,51.82 47.62,53.98
QEP_2B
  Top 0.203: 32.38,53.34 33.35,54.3 70.08,54.3 70.43,53.95 72.24,53.95 73.53,52.65 73.53,52.02
  Top 0.254: BBB_HEADERS.11 29.46,50.16 30.73,51.44 31.88,51.44 32.38,51.94 32.38,53.34 | 73.53,52.7 73.53,52.02 73.53,46.86 74.68,45.72 74.68,43.59 76.1,42.16 E3.4
QEP_4A  (via drill 0.5)
  Top 0.254: BBB_HEADERS.16 34.16,52.7 35.43,51.44 36.83,51.44 37.46,50.8 37.46,49.4 36.96,48.9 36.37,48.9 v35.61,48.13 | E4.3 20.21,9.13 19.56,9.78 19.56,12.06 20.62,13.13 20.62,19.1 21.59,20.07 28.65,20.07 31.62,23.04 31.62,30.35 33.53,32.26 v33.53,43.64
  Bottom 0.254: v33.53,43.64 33.53,47.6 34.06,48.13 v35.61,48.13
QEP_4B  (via drill 0.5)
  Top 0.254: E4.4 20.45,8.13 19.05,9.53 19.05,12.45 20.12,13.51 20.12,19.23 21.46,20.57 28.45,20.57 31.11,23.24 31.11,30.61 33.02,32.51 33.02,41.25 v32.77,41.63 | BBB_HEADERS.15 33.66,49.02 v32.77,48.13
  Bottom 0.254: v32.77,48.13 v32.77,41.63
RESET  (via drill 0.5)
  Top 0.254: BBB_HEADERS.56 24.77,3.17 17.78,3.17 17.14,3.81 17.14,7.49 16.51,8.13 v15.24,8.13 | RESET.P$2 2.03,17.4 3.56,15.88 3.56,10.67 4.19,10.03 v7.11,10.03
  Bottom 0.254: v15.24,8.13 9.02,8.13 v7.11,10.03
SERVO_EN  (via drill 0.5 pad 0.25)
  Top 0.254: 6VREG.8 49.16,29.46 60.33,29.46 60.83,29.97 60.83,32.26 v60.07,32.89 R46.2 | BBB_HEADERS.36 60.33,51.44 60.33,49.28 61.09,48.51 61.09,37.97 v61.47,37.59
  Bottom 0.254: v61.47,37.59 60.07,36.2 v60.07,32.89
SPI1_MISO
  Top 0.254: BBB_HEADERS.75 50.16,3.17 50.16,5.11 48.62,6.66 48.62,8.18 49.22,8.79 49.22,10.76 48.97,11.02 SPI1.1.4
  Top 0.406: SPI1.1.4 SPI1.2.4
SPI1_MOSI
  Top 0.254: BBB_HEADERS.76 51.43,9.78 49.28,11.94 47.96,11.94 SPI1.1.3
  Top 0.406: SPI1.2.3 SPI1.1.3
SPI1_SCK  (via drill 0.5, 0.5 pad 0.25)
  Top 0.254: v45.34,10.03 45.34,10.02 | BBB_HEADERS.77 52.7,3.17 52.7,6.73 v52.45,6.99
  Top 0.406: SPI1.1.5 45.34,10.02 SPI1.2.5
  Bottom 0.254: 52.05,7.35 v52.45,6.99 52.42,6.99 52.05,7.35 | 52.05,7.35 49.15,10.03 v45.34,10.03
SPI1_SS1
  Top 0.254: BBB_HEADERS.74 47.88,5.46 SPI1.1.6
SPI1_SS2
  Top 0.203: 47.62,1.27 47.09,0.74 44.98,0.74 BBB_HEADERS.69
  Top 0.254: SPI1.2.6 45.72,9.02 46.86,7.87 46.86,5.71 47.62,4.95 47.62,1.27
SVO1
  Top 0.254: R36.1 R50.1 63.12,28.19 61.98,29.21 61.98,32.89 59.05,35.81 59.05,46.35 58.8,46.61 52.45,46.61 BBB_HEADERS.27
SVO2
  Top 0.254: BBB_HEADERS.28 50.16,51.44 50.16,49.66 52.7,47.12 59.05,47.12 59.56,46.61 59.56,36.07 62.48,33.15 62.48,31.45 R51.1 R37.1
SVO3
  Top 0.254: R38.1 R52.1 60.07,36.4 60.07,46.99 59.44,47.62 52.96,47.62 51.43,49.15 BBB_HEADERS.29
SVO4
  Top 0.254: BBB_HEADERS.30 52.7,51.44 52.7,49.15 53.72,48.13 59.82,48.13 60.58,47.37 60.58,36.7 62.74,34.54 R39.1 R53.1
SVO5
  Top 0.254: BBB_HEADERS.39 63.75,49.78 63.75,49.66 62.1,47.88 62.1,39.45 63.19,38.35 R40.1
SVO6
  Top 0.254: BBB_HEADERS.40 65.41,51.44 65.41,49.53 62.59,46.71 62.59,40.23 R41.1
SVO7
  Top 0.254: R42.1 63.09,42.04 63.09,46.33 66.67,49.91 BBB_HEADERS.41
SVO8
  Top 0.254: BBB_HEADERS.42 66.67,52.07 67.94,50.8 67.94,49.51 67.26,48.82 66.45,48.82 64.26,46.63 R43.1
SYS_5V  (via drill 0.5)
  Top 0.406: v38.66,10.16 38.52,10.02 GPS.5
  Bottom 0.406: v38.66,10.16 38.66,8.38 37.13,6.86 29.01,6.86 27.94,5.79 24.84,5.79 BBB_HEADERS.54 BBB_HEADERS.53
UART1_RX
  Top 0.203: 44.31,17.89 41.45,15.04 41.45,8.46 43.56,6.35
  Top 0.254: UART1.3 44.31,17.89 | BBB_HEADERS.72 44.45,6.35 43.56,6.35
UART1_TX
  Top 0.203: 43.81,5.21 41.05,7.98 41.05,15.52 43.31,17.78
  Top 0.254: UART1.4 43.31,17.78 | BBB_HEADERS.70 43.81,5.21
UART2_RX  (via drill 0.5 pad 0.25)
  Top 0.254: BBB_HEADERS.68 41.27,5.84 v40.64,6.48 | 37.26,12.06 GPS.3 39.3,12.02 v39.73,11.58
  Bottom 0.254: v40.64,6.48 40.13,6.99 40.13,11.23 v39.73,11.58
UART2_TX
  Top 0.254: BBB_HEADERS.67 40,3.17 40,5.21 38.23,6.99 38.23,8.51 39.5,9.78 39.5,10.54 38.96,11.02 GPS.4
UART4_RX  (via drill 0.5 pad 0.25)
  Top 0.254: v27.3,6.86 27.3,6.48 28.07,5.71 29.21,5.71 29.85,5.08 29.85,3.56 28.57,2.29 BBB_HEADERS.57
  Bottom 0.254: v27.3,6.86 27.94,7.49 33.27,7.49 33.78,8 DSM2.P$3
UART5_RX  (via drill 0.5)
  Top 0.203: 47.75,53.21 48.39,53.85 54.91,53.85 v55.27,53.54
  Top 0.254: UART5.3 51.94,20.94 51.94,19.94 51.69,19.68 50.67,19.68 50.04,20.32 50.04,21.13 47.04,24.13 43.31,24.13 40.64,21.46 33.73,21.46 32.16,23.04 32.13,30.1 34.04,32 34.04,40.66 v37.34,43.97 | 47.75,53.21 47.75,49.53 47.12,48.9 37.85,48.9 37.34,48.39 v37.34,48.01
  Bottom 0.254: BBB_HEADERS.38 60.3,51.41 55.88,51.41 55.27,52.02 v55.27,53.54 | v37.34,43.97 v37.34,48.01
UART5_TX  (via drill 0.5, 0.5 pad 0.25)
  Top 0.254: v60.96,28.83 50.93,28.83 v50.42,28.45 | v50.42,24 50.93,23.5 UART5.4 | BBB_HEADERS.37 61.59,38.86 62.48,37.97 62.48,36.83 62.23,36.58 v62.23,36.45
  Bottom 0.254: v50.42,28.45 v50.42,24 | v60.96,28.83 60.96,35.18 v62.23,36.45
V_BATT  (via drill 0.5, 0.5 pad 0.25, 0.6 pad 0.25, 0.6 pad 0.61)  (8 unrouted)
  Top 0.254: 81.16,29.71 H2.14 | R19.1 66.55,8.38 v65.79,9.14 | R34.1 41.66,47.88 41.66,47.62 41.78,47.88 | 65.79,10.03 65.79,10.14 H1.24 | 55.12,23.37 55.12,23.24 arc90 55.83,22.66 | C25.1 31.88,36.32 | C26.1 31.88,37.97 | 33.4,29.97 33.4,30.35 | R28.1 41.6,41.35 41.6,41.4
  Top 0.406: H2.24 74.68,29.04 | 45.07,30.86 v45.21,30.86 6VREG.9 | v75.18,28.45 v74.17,28.45 | H2.14 81.16,28.96 arc-90 v80.64,28.45 | H2.13 81.81,28.59 arc-90 v81.66,28.45
  Top 0.61: 74.68,29.04 v75.18,28.45 | C20.2 56.02,34.17 v54.91,34.16 | 6VREG.9 45.34,30.86 v44.58,31.62 | v74.17,28.45 74.68,29.08 | v80.64,28.45 v81.66,28.45 | v65.79,9.14 65.79,10.03 | R4.1 31.37,47.12 31.62,46.86
  Top 2.184: 55.12,23.37 56.52,21.97 64.39,21.97
  Bottom 0.254: 67.44,11.3 65.79,11.18
  Bottom 0.61: 65.79,16.38 65.79,11.18 v65.79,9.14 | v54.91,34.16 56.01,34.16 | v44.58,31.62 44.58,32.26
  Bottom 1.778: 55.12,33.4 v54.91,34.16
  Bottom 2.184: 55.12,33.4 55.12,23.37 56.52,21.97
  other vias: 45.85,31.62 47.12,31.62 46.48,30.86 44.58,30.1 45.85,30.1 47.12,30.1 68.33,20.29 66.75,18.72 68.33,18.72 54.76,23.72 55.7,23.6 55.83,22.68 56.85,21.67 54.89,22.78 55.91,21.74 56.74,22.58 67.54,19.51 66.85,16.97 67.54,17.93
  pour Bottom (rank 2, no thermals): 53.21,48.13 53.21,36.96 50.04,33.78 43.94,33.66 42.8,32.51 42.8,29.21 43.81,28.19 58.17,28.19 58.17,48.13
  pour Bottom (rank 5, no thermals): 73.41,29.97 82.68,29.97 82.55,14.86 68.58,14.86 68.71,8.13 64.39,8.13 64.52,18.06 73.38,27
  pour Top: 59.72,22.73 65.81,16.54 68.73,16.54 68.71,22.73
  pour Top (no thermals): 31.24,48.03 41.83,48.03 41.83,32.64 47.88,32.64 47.88,29.08 42.29,29.08 42.29,23.88 42.16,21.59 31.24,21.46
  pour Top: 19.69,34.92 32.51,34.92 32.51,31.24 19.69,31.24
V_DIV_BAT
  Top 0.254: 66.42,6.6 R19.2 R25.1 67.56,5.46 67.94,5.08 67.94,3.68 67.44,3.17 60.33,3.17 BBB_HEADERS.81
V_DIV_DC  (via drill 0.5, 0.5 pad 0.25)
  Top 0.254: BBB_HEADERS.82 60.83,6.22 62.1,6.22 62.99,7.11 62.99,7.75 64.01,8.76 64.01,9.4 v63.37,10.29 | R1.2 R14.1 38.41,19.3 39.37,19.3 40.64,20.57 v40.77,20.57
  Bottom 0.254: v63.37,10.29 63.37,10.67 63.63,10.92 63.63,13.46 63.25,13.84 41.15,13.84 40.77,14.22 v40.77,20.57
VCC  (via drill 0.5 pad 0.25)
  Top 0.254: R1.1 37.26,20.52 37.34,20.57 v34.92,20.57 | CHG.A 19.56,43.19 19.56,39.76 19.37,39.76
  Top 0.305: CHGIC.2 23.37,38.61 22.62,39.36 C12.1
  Top 0.813: C7.1 C12.1 | D3.A 20.65,24.33 20.89,24.57
  Top 1.016: 29.85,27.48 JACK.1 27.18,27.94 23.75,24.51 20.96,24.51 20.89,24.57 18.62,26.85 18.62,35.13 19.25,35.76 19.25,39.62 19.37,39.76 19.7,40.12 C7.1
  Bottom 0.254: v34.92,20.57 29.36,26.11 JACK.1
VCC_CHG  (via drill 0.5)
  Top 0.254: C4.2 28.19,34.42 | 28.19,34.42 R5.2 | v28.19,33.66 28.19,34.42 | 22.86,36.96 CHGIC.3 22.86,38.35 22.61,38.61 v21.84,38.61 21.64,38.81
  Bottom 0.254: v21.84,38.61 21.97,38.61 26.92,33.66 v28.19,33.66
VDD_ADC
  Top 0.254: ADC.2 53.15,13.08 52.32,13.08 51.94,12.7 51.94,8.64 53.34,7.24 53.34,6.5 53.97,5.87 BBB_HEADERS.78

## Text on the board
tPlace: 9-18V